# Altium schematic sheet Clock Segment.SchDoc
size A3; Organization: Altium Limited; Address1: L3, 12a Rodborough Rd; Address2: Frenchs Forest; Address3: NSW; Address4: Australia 2086
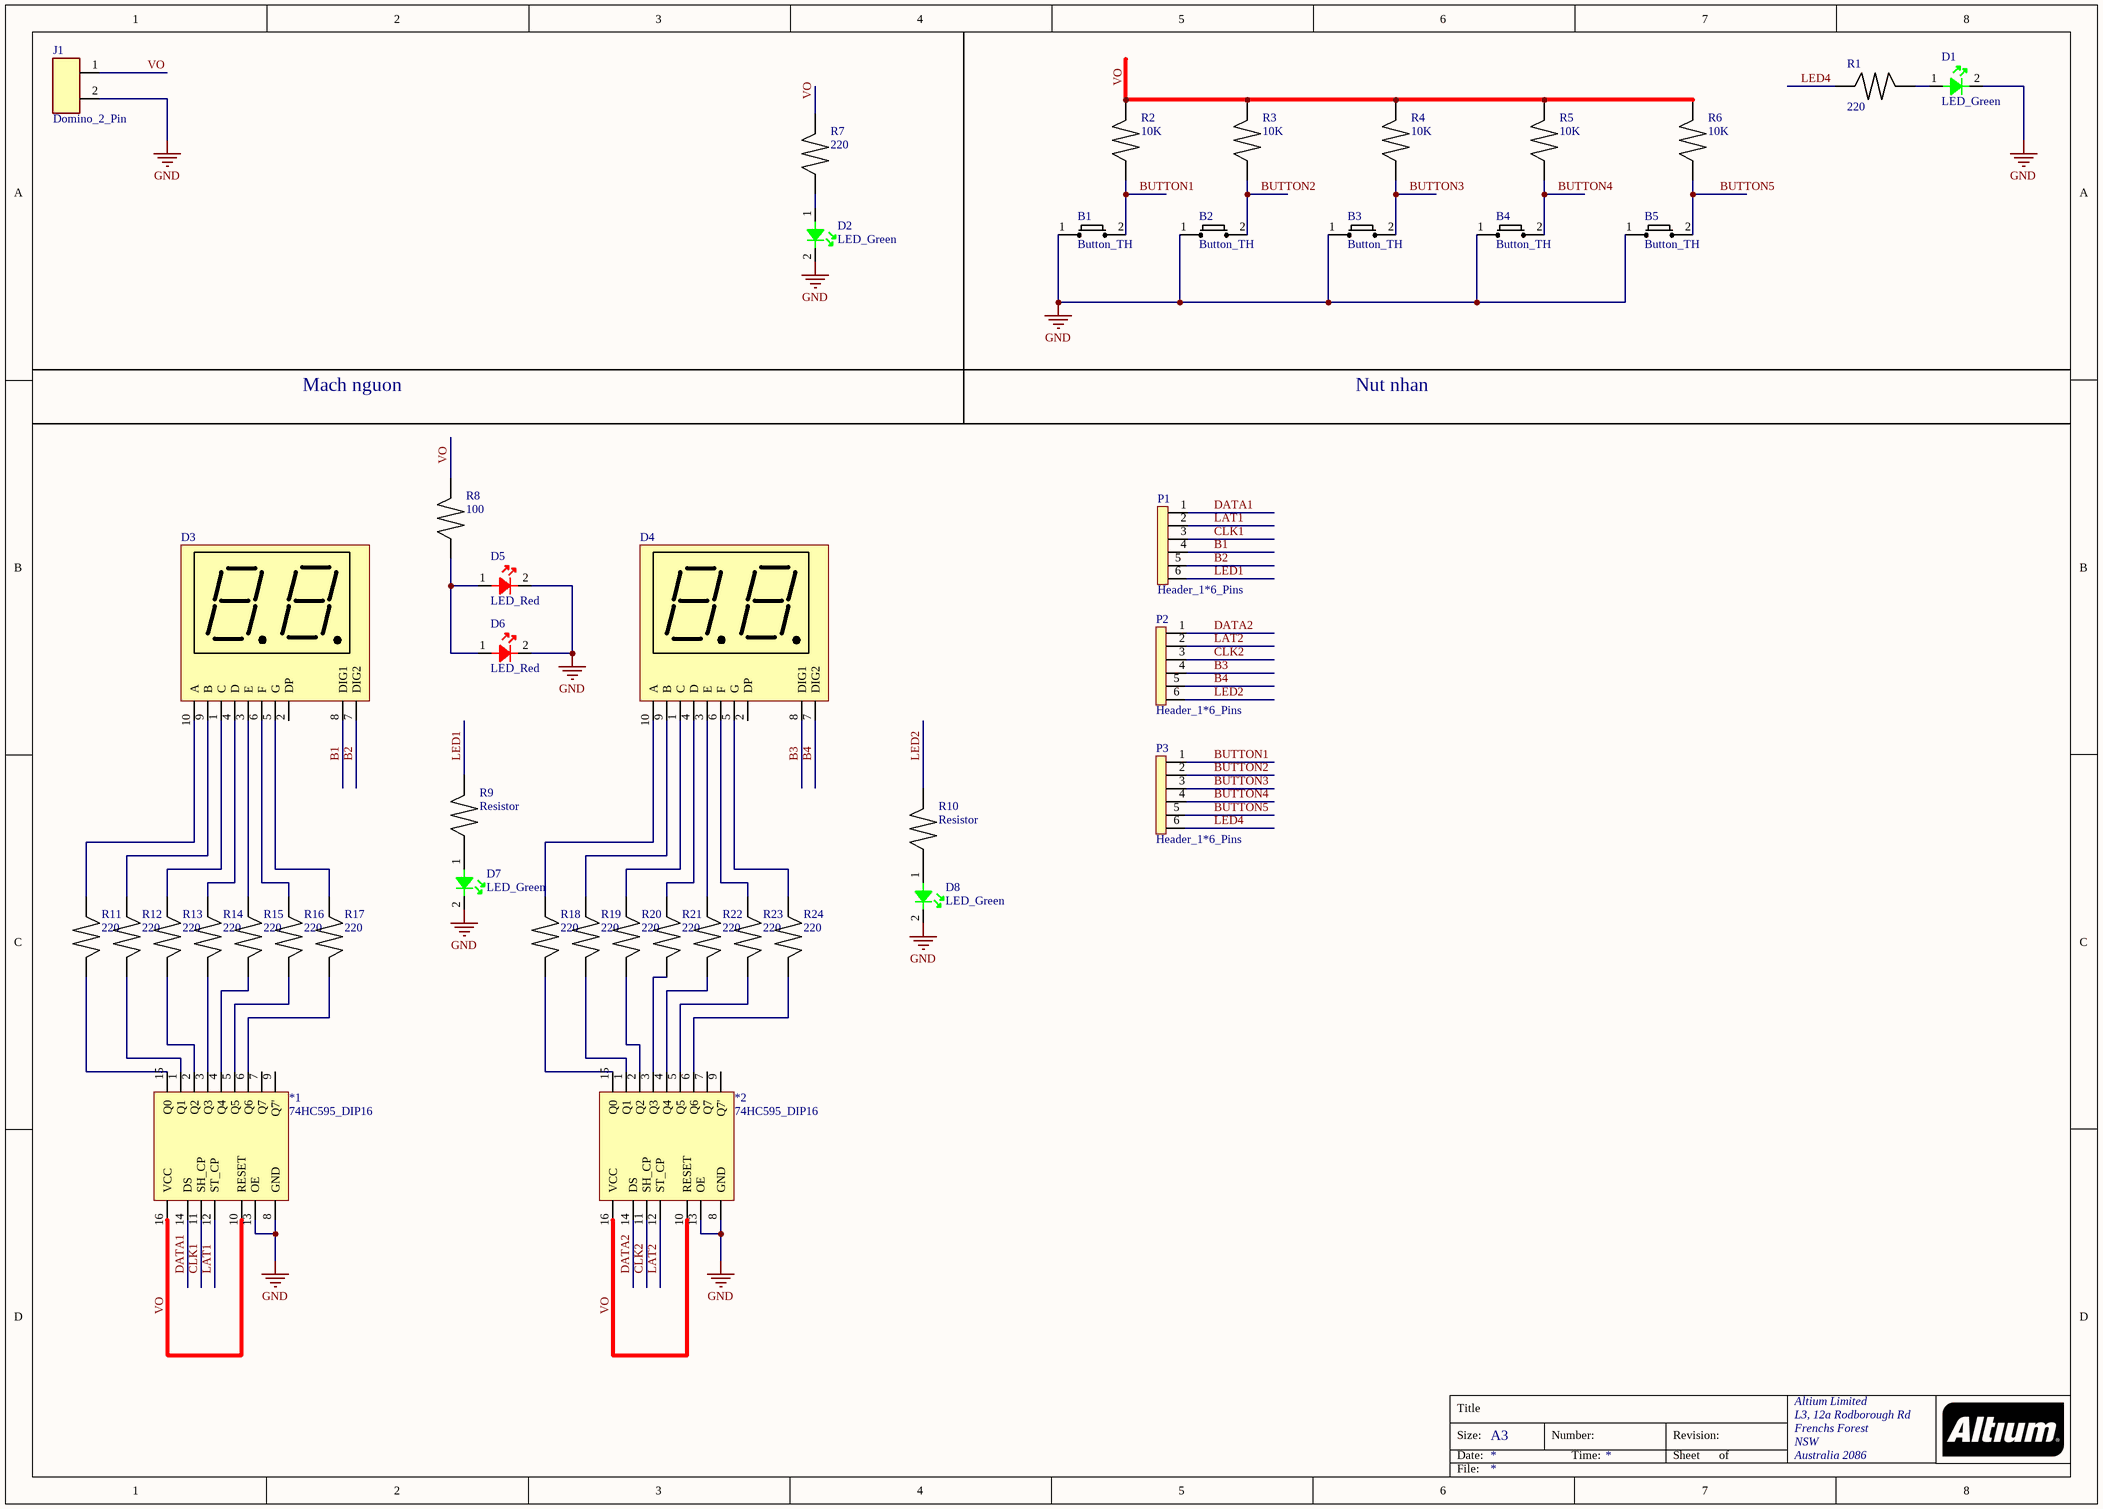
[diagram p0: Clock Segment.SchDoc]

## Parts
*1  74HC595_DIP16  [DIP_16]
*2  74HC595_DIP16  [DIP_16]
B1  Button_TH  [BUTTON_TH]
B2  Button_TH  [BUTTON_TH]
B3  Button_TH  [BUTTON_TH]
B4  Button_TH  [BUTTON_TH]
B5  Button_TH  [BUTTON_TH]
D1  LED_Green  [LED_Green_TH_5mm]
D2  LED_Green  [LED_Green_TH_5mm]
D3  7_Segment_2_Figures  [5621BS]  (value not drawn)
D4  7_Segment_2_Figures  [5621BS]  (value not drawn)
D5  LED_Red  [LED_Red_TH_5mm]
D6  LED_Red  [LED_Red_TH_5mm]
D7  LED_Green  [LED_Green_TH_5mm]
D8  LED_Green  [LED_Green_TH_5mm]
J1  Domino_2_Pin  [domino_2_pin]
P1  Header_1*6_Pins  [HDR_M_6_Pins_2.54]
P2  Header_1*6_Pins  [HDR_M_6_Pins_2.54]
P3  Header_1*6_Pins  [HDR_M_6_Pins_2.54]
R1  220  [Resistor_TH_1/4W]
R2  10K  [Resistor_TH_1/4W]
R3  10K  [Resistor_TH_1/4W]
R4  10K  [Resistor_TH_1/4W]
R5  10K  [Resistor_TH_1/4W]
R6  10K  [Resistor_TH_1/4W]
R7  220  [Resistor_TH_1/4W]
R8  100  [Resistor_TH_1/4W]
R9  Resistor  [Resistor_TH_1/4W]
R10  Resistor  [Resistor_TH_1/4W]
R11  220  [Resistor_TH_1/4W]
R12  220  [Resistor_TH_1/4W]
R13  220  [Resistor_TH_1/4W]
R14  220  [Resistor_TH_1/4W]
R15  220  [Resistor_TH_1/4W]
R16  220  [Resistor_TH_1/4W]
R17  220  [Resistor_TH_1/4W]
R18  220  [Resistor_TH_1/4W]
R19  220  [Resistor_TH_1/4W]
R20  220  [Resistor_TH_1/4W]
R21  220  [Resistor_TH_1/4W]
R22  220  [Resistor_TH_1/4W]
R23  220  [Resistor_TH_1/4W]
R24  220  [Resistor_TH_1/4W]

## Nets
GND: *1.8(GND) *1.13(OE) *2.8(GND) *2.13(OE) B1.1 B2.1 B3.1 B4.1 B5.1 D1.2 D2.2 D5.2 D6.2 D7.2 D8.2 J1.2
B1: D3.8(DIG1) P1.4
B2: D3.7(DIG2) P1.5(3.81)
B3: D4.8(DIG1) P2.4
B4: D4.7(DIG2) P2.5(3.81)
BUTTON1: B1.2 P3.1 R2.1
BUTTON2: B2.2 P3.2 R3.1
BUTTON3: B3.2 P3.3 R4.1
BUTTON4: B4.2 P3.4 R5.1
BUTTON5: B5.2 P3.5(3.81) R6.1
CLK1: *1.11(SH_CP) P1.3
CLK2: *2.11(SH_CP) P2.3
DATA1: *1.14(DS) P1.1
DATA2: *2.14(DS) P2.1
LAT1: *1.12(ST_CP) P1.2
LAT2: *2.12(ST_CP) P2.2
LED1: P1.6(3.81) R9.2
LED2: P2.6(3.81) R10.2
LED4: P3.6(3.81) R1.1
VO: *1.10(RESET) *1.16(VCC) *2.10(RESET) *2.16(VCC) J1.1 R2.2 R3.2 R4.2 R5.2 R6.2 R7.2 R8.2
Net*1_1: *1.1(Q1) R12.2
Net*1_2: *1.2(Q2) R13.2
Net*1_3: *1.3(Q3) R14.2
Net*1_4: *1.4(Q4) R15.2
Net*1_5: *1.5(Q5) R16.2
Net*1_6: *1.6(Q6) R17.2
Net*1_15: *1.15(Q0) R11.2
Net*2_1: *2.1(Q1) R19.2
Net*2_2: *2.2(Q2) R20.2
Net*2_3: *2.3(Q3) R21.2
Net*2_4: *2.4(Q4) R22.2
Net*2_5: *2.5(Q5) R23.2
Net*2_6: *2.6(Q6) R24.2
Net*2_15: *2.15(Q0) R18.2
NetD1_1: D1.1 R1.2
NetD2_1: D2.1 R7.1
NetD3_1: D3.1(C) R13.1
NetD3_3: D3.3(E) R15.1
NetD3_4: D3.4(D) R14.1
NetD3_5: D3.5(G) R17.1
NetD3_6: D3.6(F) R16.1
NetD3_9: D3.9(B) R12.1
NetD3_10: D3.10(A) R11.1
NetD4_1: D4.1(C) R20.1
NetD4_3: D4.3(E) R22.1
NetD4_4: D4.4(D) R21.1
NetD4_5: D4.5(G) R24.1
NetD4_6: D4.6(F) R23.1
NetD4_9: D4.9(B) R19.1
NetD4_10: D4.10(A) R18.1
NetD5_1: D5.1 D6.1 R8.1
NetD7_1: D7.1 R9.1
NetD8_1: D8.1 R10.1

Not connected (* = marked no-connect by the designer): *1 7(Q7) 9(Q7'); *2 7(Q7) 9(Q7'); D3 2(DP); D4 2(DP)

## Notes on the sheet
- Mach nguon
- Nut nhan
- Title
- Size:
- Date:
- A3
- Number:
- Time:
- Revision:
- Sheet
- of
- File:

## Library data of the parts
B1-B5 = Button_TH: 6x6mm, TH, 2 Pins
R1-R24 = Resistor: Resistor_TH_1/4W